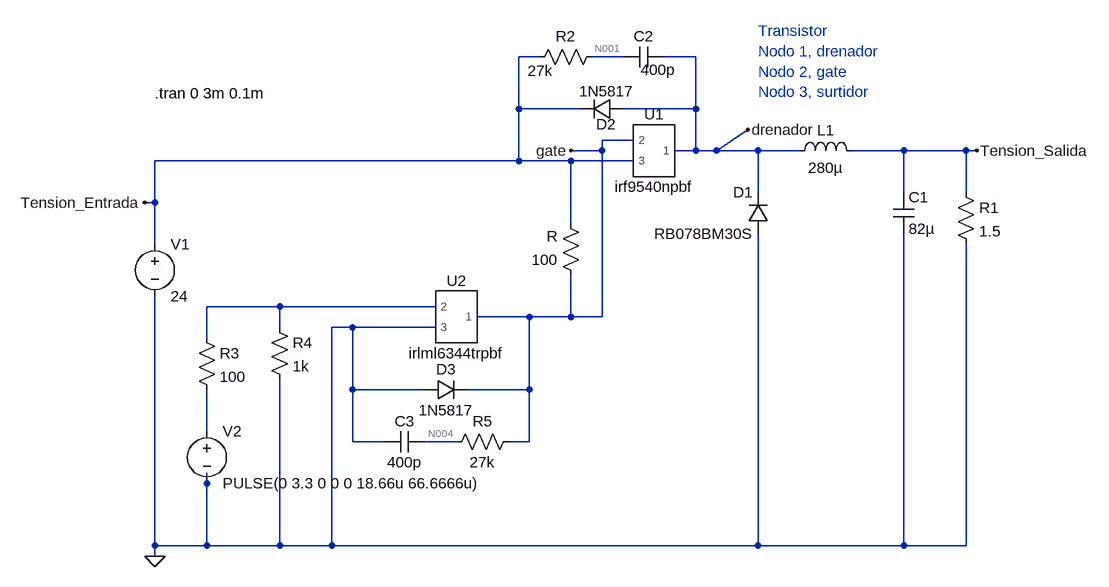
[diagram p0: schematic buck_mosfet_15k.asc]
buck_mosfet_15k.asc, the LTspice schematic file:
Version 4.1
SHEET 1 1456 776
WIRE 336 -32 304 -32
WIRE 464 -32 416 -32
WIRE 576 -32 528 -32
WIRE 304 48 304 -32
WIRE 400 48 304 48
WIRE 576 48 576 -32
WIRE 576 48 464 48
WIRE 480 96 432 96
WIRE 432 112 432 96
WIRE 432 112 384 112
WIRE 576 112 576 48
WIRE 576 112 544 112
WIRE 608 112 656 80
WIRE 608 112 576 112
WIRE 672 112 608 112
WIRE 736 112 672 112
WIRE 896 112 816 112
WIRE 992 112 896 112
WIRE 1008 112 992 112
WIRE 304 128 304 48
WIRE 304 128 -256 128
WIRE 384 128 304 128
WIRE 480 128 384 128
WIRE 672 176 672 112
WIRE 896 176 896 112
WIRE 992 176 992 112
WIRE -256 192 -256 128
WIRE -256 192 -272 192
WIRE 384 224 384 128
WIRE -256 256 -256 192
WIRE -64 352 -176 352
WIRE 176 352 -64 352
WIRE 320 368 240 368
WIRE 384 368 384 304
WIRE 384 368 320 368
WIRE 432 368 432 112
WIRE 432 368 384 368
WIRE -64 384 -64 352
WIRE 48 384 16 384
WIRE 176 384 48 384
WIRE -176 400 -176 352
WIRE 48 480 48 384
WIRE 160 480 48 480
WIRE 320 480 320 368
WIRE 320 480 224 480
WIRE -176 544 -176 480
WIRE 48 560 48 480
WIRE 96 560 48 560
WIRE 208 560 160 560
WIRE 320 560 320 480
WIRE 320 560 288 560
WIRE -176 624 -176 608
WIRE -256 720 -256 336
WIRE -176 720 -176 624
WIRE -176 720 -256 720
WIRE -64 720 -64 464
WIRE -64 720 -176 720
WIRE 16 720 16 384
WIRE 16 720 -64 720
WIRE 672 720 672 240
WIRE 672 720 16 720
WIRE 896 720 896 240
WIRE 896 720 672 720
WIRE 992 720 992 256
WIRE 992 720 896 720
WIRE -256 736 -256 720
FLAG -256 736 0
FLAG 1008 112 Tension_Salida
FLAG -272 192 Tension_Entrada
FLAG 384 112 gate
FLAG 656 80 drenador
SYMBOL diode 688 240 R180
WINDOW 0 24 64 Left 2
WINDOW 3 24 0 Left 2
SYMATTR InstName D1
SYMATTR Value RB078BM30S
SYMBOL res 976 160 R0
SYMATTR InstName R1
SYMATTR Value 1.5
SYMBOL voltage -256 240 R0
WINDOW 123 0 0 Left 0
WINDOW 39 0 0 Left 0
SYMATTR InstName V1
SYMATTR Value 24
SYMBOL voltage -176 528 R0
WINDOW 123 0 0 Left 0
WINDOW 39 0 0 Left 0
SYMATTR InstName V2
SYMATTR Value PULSE(0 3.3 0 0 0 18.66u 66.6666u)
SYMBOL ind 720 128 R270
WINDOW 0 32 56 VTop 2
WINDOW 3 5 56 VBottom 2
SYMATTR InstName L1
SYMATTR Value 280µ
SYMBOL cap 880 176 R0
SYMATTR InstName C1
SYMATTR Value 82µ
SYMBOL res 432 -48 R90
WINDOW 0 0 56 VBottom 2
WINDOW 3 22 95 VTop 2
SYMATTR InstName R2
SYMATTR Value 27k
SYMBOL cap 528 -48 R90
WINDOW 0 0 32 VBottom 2
WINDOW 3 20 10 VTop 2
SYMATTR InstName C2
SYMATTR Value 400p
SYMBOL diode 464 32 R90
WINDOW 0 55 26 VBottom 2
WINDOW 3 -27 25 VTop 2
SYMATTR InstName D2
SYMATTR Value 1N5817
SYMBOL res 400 320 R180
WINDOW 0 36 76 Left 2
WINDOW 3 36 40 Left 2
SYMATTR InstName R
SYMATTR Value 100
SYMBOL res -80 368 R0
SYMATTR InstName R4
SYMATTR Value 1k
SYMBOL res -192 384 R0
SYMATTR InstName R3
SYMATTR Value 100
SYMBOL irf9540npbf 512 112 M0
SYMATTR InstName U1
SYMBOL irlml6344trpbf_win 208 368 M0
SYMATTR InstName U2
SYMBOL res 192 576 R270
WINDOW 0 32 56 VTop 2
WINDOW 3 0 56 VBottom 2
SYMATTR InstName R5
SYMATTR Value 27k
SYMBOL cap 96 576 R270
WINDOW 0 32 32 VTop 2
WINDOW 3 0 32 VBottom 2
SYMATTR InstName C3
SYMATTR Value 400p
SYMBOL diode 160 496 R270
WINDOW 0 32 32 VTop 2
WINDOW 3 0 32 VBottom 2
SYMATTR InstName D3
SYMATTR Value 1N5817
TEXT -256 24 Left 2 !.tran 0 3m 0.1m
TEXT 672 -72 Left 2 ;Transistor\nNodo 1, drenador\nNodo 2, gate\nNodo 3, surtidor

The netlist it stands for:
* buck_mosfet_15k.asc
D1 0 drenador RB078BM30S
R1 Tension_Salida 0 1.5
V1 Tension_Entrada 0 24
V2 N003 0 PULSE(0 3.3 0 0 0 18.66u 66.6666u)
L1 drenador Tension_Salida 280µ
C1 Tension_Salida 0 82µ
R2 N001 Tension_Entrada 27k
C2 drenador N001 400p
D2 drenador Tension_Entrada 1N5817
R gate Tension_Entrada 100
R4 N002 0 1k
R3 N002 N003 100
X§U1 drenador gate Tension_Entrada irf9540npbf  ; pins 1 2 3
X§U2 gate N002 0 irlml6344trpbf  ; pins 1 2 3
R5 N004 gate 27k
C3 0 N004 400p
D3 0 gate 1N5817
.model D D
.lib standard.dio
.tran 0 3m 0.1m
* Transistor
* Nodo 1, drenador
* Nodo 2, gate
* Nodo 3, surtidor
.lib D:\RepositorioGitHub\ProyectoFinal\Prototipos\Buck #1\Simulación\Modelos_spice\Infineon-Spice File-IRF9540NPBF-SM-v01_00-EN.spi
.lib D:\RepositorioGitHub\ProyectoFinal\Prototipos\Buck #1\Simulación\Modelos_spice\IRLML6344.spi
.backanno
.end

* Results of the author's LTspice run, read from the files saved beside the schematic
* Operating Point, zero values left out:
*   V(tension_salida) = 49.36 µV
*   V(n001) = 24 V
*   V(drenador) = 49.39 µV
*   V(tension_entrada) = 24 V
*   V(gate) = 24 V
*   V(n004) = 24 V
*   I(V1) = -65.11 µA
*   I(R4) = 2.182 pA
*   I(D1) = -35.62 pA
*   I(L1) = 32.9 µA
*   I(R3) = 21.82 pA
*   I(D3) = -31.7 µA
*   I(R1) = 32.9 µA
*   I(V2) = 21.82 pA
*   I(D2) = -31.7 µA
*   I(R) = -32.2 µA
*   Ix(u2:1) = 503.2 nA
*   Ix(u2:2) = -24 pA
*   Ix(u2:3) = -503.2 nA
*   Ix(u1:1) = -1.205 µA
*   Ix(u1:2) = 24 pA
*   Ix(u1:3) = 1.205 µA
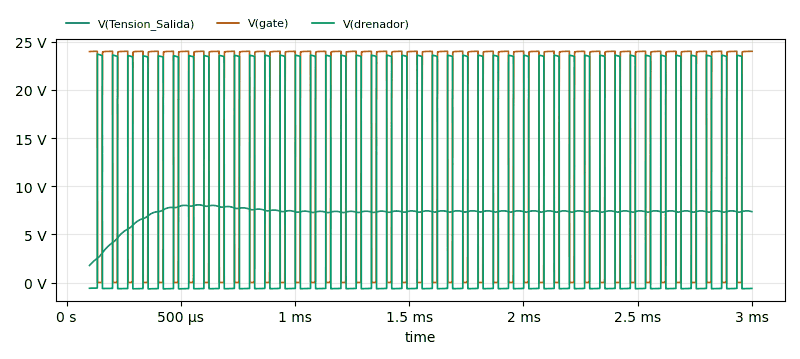
[diagram p1: Transient Analysis of buck_mosfet_15k.asc, plotted from the saved traces]
* Transient Analysis, 1 run:
*   V(Tension_Salida): min 1.769 V, max 8.067 V, average 7.204 V, rms 7.266 V, last 7.359 V
*   V(gate): min 6.202 mV, max 24 V, average 16.4 V, rms 19.75 V, last 24 V
*   V(drenador): min -649.6 mV, max 23.71 V, average 7.296 V, rms 13.45 V, last -608.2 mV